# Altium project mementos.PrjPcb
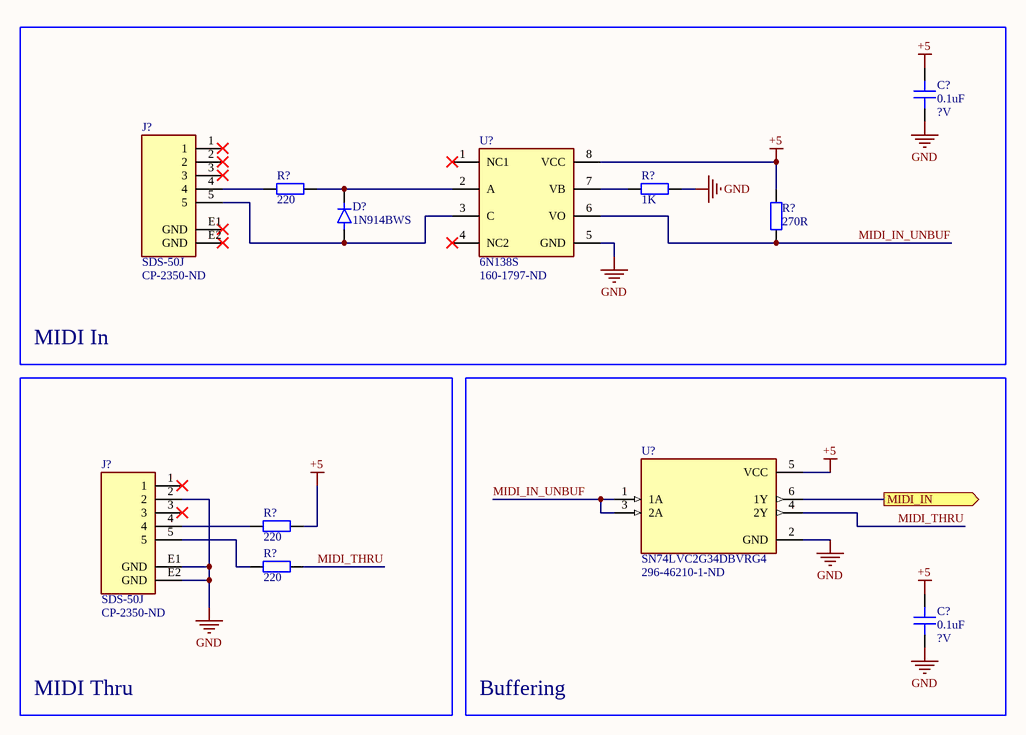
[diagram p0: MIDI.SchDoc]
4 sheets, 48 parts. Net scope: flat (ports and power ports of the same name join across sheets).
Sheets:
  Top.SchDoc
  MIDI.SchDoc
  Microphone.SchDoc
  Power.SchDoc

## Sheet Top.SchDoc
size A4; SheetNumber: 1; SheetTotal: 1

## Sheet MIDI.SchDoc
size A4; SheetNumber: 2; SheetTotal: 3

### Parts
(Parts that share a designator on the sheet are numbered #1, #2 ... from top to bottom, then left to right.)
C?#1  value 0.1uF  Voltage: ?V  [CAP 0402/1005]  (hidden comment: Capacitor_SMD)
C?#2  value 0.1uF  Voltage: ?V  [CAP 0402/1005]  (hidden comment: Capacitor_SMD)
D?  1N914BWS  [DIO_1N914BWS_RR]
J?#1  SDS-50J  Supplier Part Number 1: CP-2350-ND  [CUI_SDS-50J]
J?#2  SDS-50J  Supplier Part Number 1: CP-2350-ND  [CUI_SDS-50J]
R?#1  value 220  [RES 0805/2012]  (hidden comment: Resistor_SMD)
R?#2  value 1K  [RES 0805/2012]  (hidden comment: Resistor_SMD)
R?#3  value 270R  [RES 0805/2012]  (hidden comment: Resistor_SMD)
R?#4  value 220  [RES 0805/2012]  (hidden comment: Resistor_SMD)
R?#5  value 220  [RES 0805/2012]  (hidden comment: Resistor_SMD)
U?#1  6N138S  Supplier Part Number 1: 160-1797-ND  [SMDIP8]
U?#2  SN74LVC2G34DBVRG4  Supplier Part Number 1: 296-46210-1-ND  [SOT95P280X145-6N]

### Blocks framed on the sheet
MIDI In: C?#1 D? J?#1 R?#1-R?#3 U?#1
MIDI Thru: J?#2 R?#4 R?#5
Buffering: C?#2 U?#2

### Ports
MIDI_IN (out)

### Nets
+5: C?#1.1 C?#2.1 R?#3.1 R?#4.1 U?#1.8(VCC) U?#2.5(VCC)
GND: C?#1.2 C?#2.2 J?#2.2 J?#2.E1(GND) J?#2.E2(GND) R?#2.1 U?#1.5(GND) U?#2.2(GND)
MIDI_IN_UNBUF: R?#3.2 U?#1.6(VO) U?#2.1(1A) U?#2.3(2A)
MIDI_THRU: R?#5.1 U?#2.4(2Y)
NetD?_A: D?.A J?#1.5 U?#1.3(C)
NetD?_C: D?.C(K) R?#1.1 U?#1.2(A)
NetJ?#1_4: J?#1.4 R?#1.2
NetJ?#2_4: J?#2.4 R?#4.2
NetJ?#2_5: J?#2.5 R?#5.2
NetR?#2_2: R?#2.2 U?#1.7(VB)
NetU?#2_6: U?#2.6(1Y) ; port MIDI_IN

Not connected (* = marked no-connect by the designer): J?#1 1* 2* 3* E1(GND)* E2(GND)*; J?#2 1* 3*; U?#1 1(NC1)* 4(NC2)*

### Library data of the parts
C?#1 C?#2 = Capacitor_SMD: SMD Capacitor
D? = 1N914BWS: SOD-323F, 100V, 0.15A, Switching Diode & Array; MP: 1N914BWS RR; MF: Taiwan Semiconductor; Value: *; Check_prices: https://www.snapeda.com/parts/1N914BWS%20RR/Taiwan+Semiconductor/view-part/?ref=eda; Availability: In Stock; Price: None; Package: SOD-323F Taiwan Semiconductor; SnapEDA_Link: https://www.snapeda.com/parts/1N914BWS%20RR/Taiwan+Semiconductor/view-part/?ref=snap; Purchase-URL: https://pricing.snapeda.com/search/part/1N914BWS RR/?ref=eda
J?#1 J?#2 = SDS-50J: 5 Positions, Receptacle, Right Angle, Through Hole, Standard Circular DIN Connector; Value: *; MP: SDS-50J; Package: None; Availability: Unavailable; Price: None; Supplier 1: Digi-Key
R?#1-R?#5 = Resistor_SMD: SMD Resistor; Power: 100mW
U?#1 = 6N138S: Optoisolator Darlington with Base Output 5000Vrms 1 Channel 8-SMD; MF: ON Semiconductor; MP: 6N138S; SnapEDA_Link: https://www.snapeda.com/parts/6N138S/Onsemi/view-part/560668/?ref=snap; Check_prices: https://www.snapeda.com/parts/6N138S/Onsemi/view-part/560668/?ref=eda; Price: None; Availability: In Stock; Purchase-URL: https://pricing.snapeda.com/search/part/6N138S/?ref=eda; Package: SMD-8 ON Semiconductor; Value: *; Supplier 1: Digi-Key
U?#2 = SN74LVC2G34DBVRG4: Dual Buffer Gate 6-SOT-23 -40 to 125; MF: Texas Instruments; Value: *; Check_prices: https://www.snapeda.com/parts/SN74LVC2G34DBVRG4/Texas+Instruments/view-part/?ref=eda; Digi-Key_Part_Number: 296-46210-1-ND; Package: SOT-23-6 Texas Instruments; Purchase-URL: https://pricing.snapeda.com/search/part/SN74LVC2G34DBVRG4/?ref=eda; SnapEDA_Link: https://www.snapeda.com/parts/SN74LVC2G34DBVRG4/Texas+Instruments/view-part/?ref=snap; MP: SN74LVC2G34DBVRG4; Supplier 1: Digi-Key

## Sheet Microphone.SchDoc
size A4; SheetNumber: 3; SheetTotal: 3
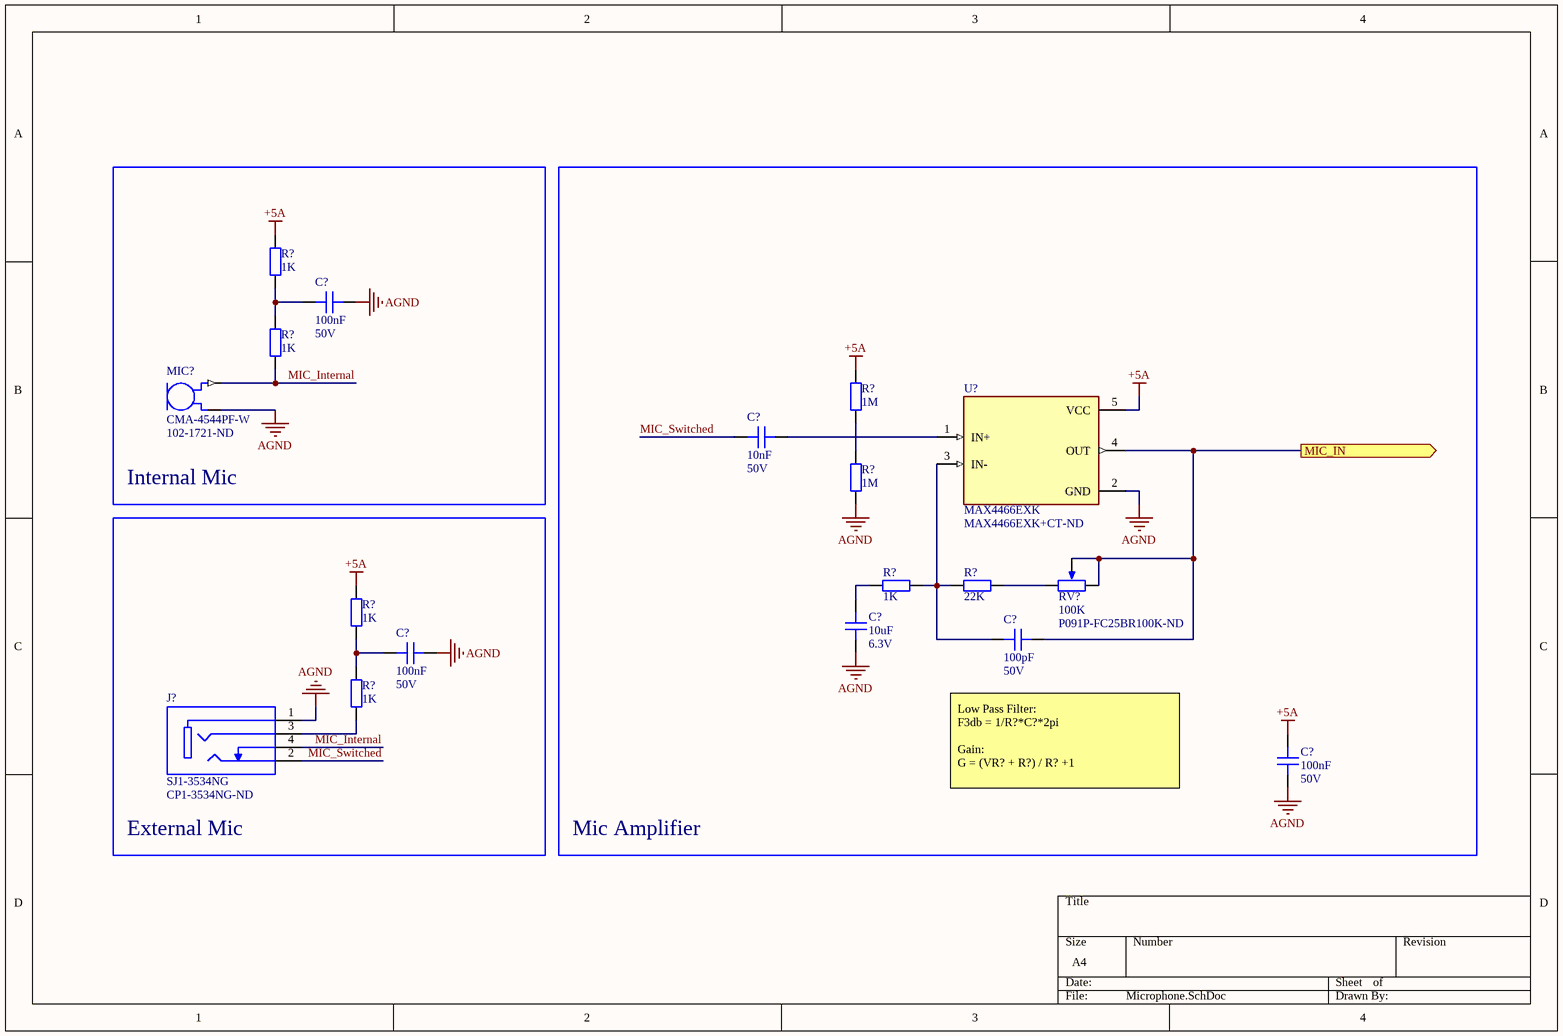
[diagram p1: Microphone.SchDoc]

### Parts
(Parts that share a designator on the sheet are numbered #1, #2 ... from top to bottom, then left to right.)
C?#3  value 100nF  Voltage: 50V  [CAP 0402/1005]  (hidden comment: Capacitor_SMD)
C?#4  value 10nF  Voltage: 50V  [CAP 0402/1005]  (hidden comment: Capacitor_SMD)
C?#5  value 10uF  Voltage: 6.3V  [CAP 0603/1608]  (hidden comment: Capacitor_SMD)
C?#6  value 100pF  Voltage: 50V  [CAP 0402/1005]  (hidden comment: Capacitor_SMD)
C?#7  value 100nF  Voltage: 50V  [CAP 0402/1005]  (hidden comment: Capacitor_SMD)
C?#8  value 100nF  Voltage: 50V  [CAP 0402/1005]  (hidden comment: Capacitor_SMD)
J?#3  SJ1-3534NG  Supplier Part Number 1: CP1-3534NG-ND  [CUI_SJ1-3534NG]
MIC?  CMA-4544PF-W  Supplier Part Number 1: 102-1721-ND  [MIC_CMA-4544PF-W]
R?#6  value 1K  [RES 0402/1005]  (hidden comment: Resistor_SMD)
R?#7  value 1K  [RES 0402/1005]  (hidden comment: Resistor_SMD)
R?#8  value 1M  [RES 0402/1005]  (hidden comment: Resistor_SMD)
R?#9  value 1M  [RES 0402/1005]  (hidden comment: Resistor_SMD)
R?#10  value 1K  [RES 0402/1005]  (hidden comment: Resistor_SMD)
R?#11  value 22K  [RES 0402/1005]  (hidden comment: Resistor_SMD)
R?#12  value 1K  [RES 0402/1005]  (hidden comment: Resistor_SMD)
R?#13  value 1K  [RES 0402/1005]  (hidden comment: Resistor_SMD)
RV?  value 100K  Supplier Part Number 1: P091P-FC25BR100K-ND  (hidden comment: P091P-FC25BR100K)
U?#3  MAX4466EXK  Supplier Part Number 1: MAX4466EXK+CT-ND  [SOT65P210X110-5N]

### Blocks framed on the sheet
Internal Mic: C?#3 MIC? R?#6 R?#7
Mic Amplifier: C?#4-C?#6 C?#8 R?#8-R?#11 RV? U?#3
External Mic: C?#7 J?#3 R?#12 R?#13

### Ports
MIC_IN (out)

### Nets
+5A: C?#8.2 R?#6.2 R?#8.2 R?#12.2 U?#3.5(VCC)
AGND: C?#3.2 C?#5.1 C?#7.2 C?#8.1 J?#3.1 MIC?.2(GND) R?#9.1 U?#3.2(GND)
MIC_Internal: J?#3.4 MIC?.1(OUT) R?#7.1
MIC_Switched: C?#4.1 J?#3.2
NetC?#3_1: C?#3.1 R?#6.1 R?#7.2
NetC?#4_2: C?#4.2 U?#3.1(IN+)
NetC?#5_2: C?#5.2 R?#10.2
NetC?#6_1: C?#6.1 RV?.2(TAP) RV?.3 U?#3.4(OUT) ; port MIC_IN
NetC?#6_2: C?#6.2 R?#10.1 R?#11.2 U?#3.3(IN-)
NetC?#7_1: C?#7.1 R?#12.1 R?#13.2
NetJ?#3_3: J?#3.3 R?#13.1
NetR?#8_1: R?#8.1 R?#9.2
NetR?#11_1: R?#11.1 RV?.1

### Notes on the sheet
- Low Pass Filter:
  F3db = 1/R?*C?*2pi
  Gain:
  G = (VR? + R?) / R? +1

### Library data of the parts
C?#3-C?#8 = Capacitor_SMD: SMD Capacitor
J?#3 = SJ1-3534NG: 3.5 mm, Stereo, Right Angle, Through Hole, Isolated Ground, Audio Jack Connector; MF: CUI Devices; SnapEDA_Link: https://www.snapeda.com/parts/SJ1-3534NG/CUI%20Devices/view-part/617954/?ref=snap; Price: None; MP: SJ1-3534NG; Package: None; Value: *; Availability: Unavailable; Supplier 1: Digi-Key
MIC? = CMA-4544PF-W: 9.7 mm, Omnidirectional, PCB Mount, 3.0 Vdc, Electret Condenser Microphone; MF: CUI Devices; CUI_purchase_URL: https://www.cuidevices.com/product/audio/microphones/electret-condenser-microphones/cma-4544pf-w?utm_source=snapeda.com&utm_medium=referral&utm_campaign=snapedaBOM; Price: None; SnapEDA_Link: https://www.snapeda.com/parts/CMA-4544PF-W/CUI%20Devices/view-part/215068/?ref=snap; Package: 6-DIP-6 CUI; Availability: Unavailable; Value: *; MP: CMA-4544PF-W; Supplier 1: Digi-Key
R?#6-R?#13 = Resistor_SMD: SMD Resistor; Power: 100mW
RV? = P091P-FC25BR100K: Potentiometer 9mm 100K ohm 20% Push Lock; Supplier 1: Digi-Key
U?#3 = MAX4466EXK: Amplifier IC 1-Channel _Mono_ Class AB SC-70-5; MF: Maxim Integrated; MP: MAX4466EXK+T; Price: None; Value: *; Package: SC-70-5 Maxim; SnapEDA_Link: https://www.snapeda.com/parts/MAX4466EXK%2BT/Maxim%20Integrated/view-part/548008/?ref=snap; Availability: Unavailable; Supplier 1: Digi-Key

## Sheet Power.SchDoc
size A4; SheetNumber: 4; SheetTotal: 4
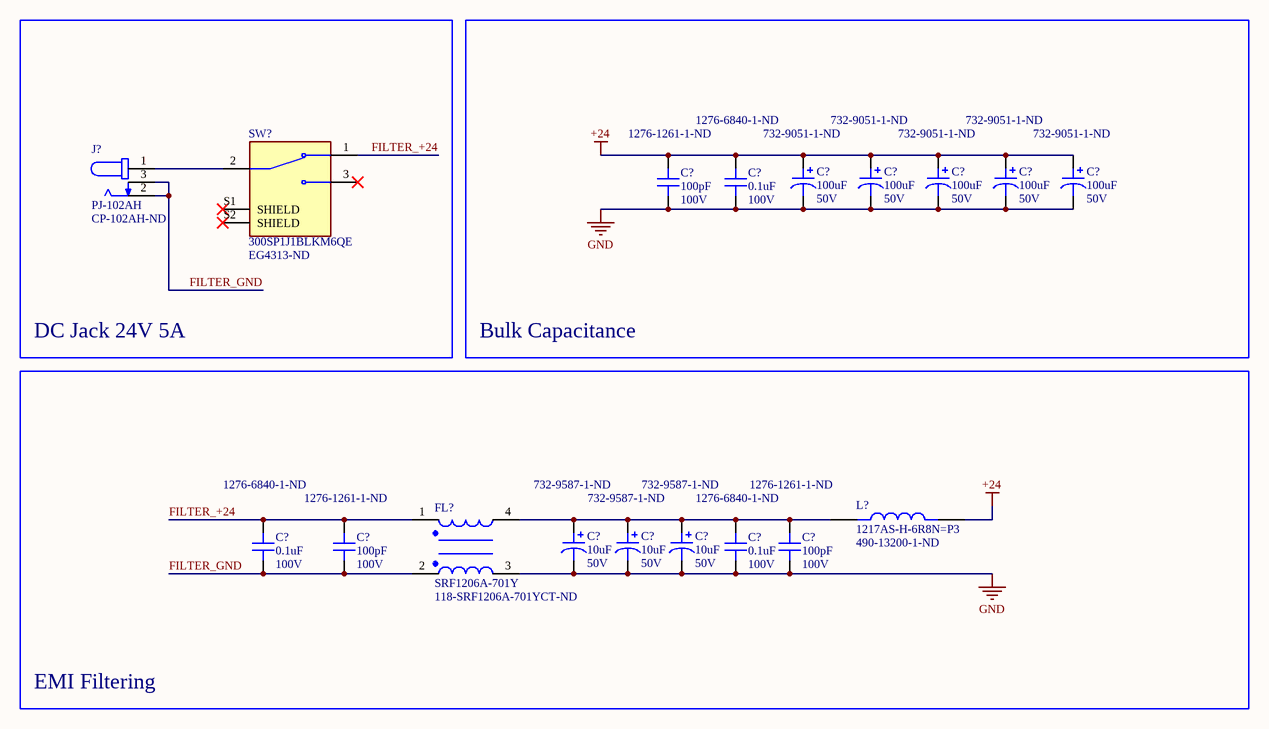
[diagram p2: Power.SchDoc]

### Parts
(Parts that share a designator on the sheet are numbered #1, #2 ... from top to bottom, then left to right.)
C?#9  value 100pF  Voltage: 100V  Supplier Part Number 1: 1276-1261-1-ND  [CAP 0402/1005]  (hidden comment: Capacitor_SMD)
C?#10  value 0.1uF  Voltage: 100V  Supplier Part Number 1: 1276-6840-1-ND  [CAP 0805/2012]  (hidden comment: Capacitor_SMD)
C?#11  value 100uF  Voltage: 50V  Supplier Part Number 1: 732-9051-1-ND  [CAP AL TH D8 L3.5 H21]  (hidden comment: Capacitor_Pol)
C?#12  value 100uF  Voltage: 50V  Supplier Part Number 1: 732-9051-1-ND  [CAP AL TH D8 L3.5 H21]  (hidden comment: Capacitor_Pol)
C?#13  value 100uF  Voltage: 50V  Supplier Part Number 1: 732-9051-1-ND  [CAP AL TH D8 L3.5 H21]  (hidden comment: Capacitor_Pol)
C?#14  value 100uF  Voltage: 50V  Supplier Part Number 1: 732-9051-1-ND  [CAP AL TH D8 L3.5 H21]  (hidden comment: Capacitor_Pol)
C?#15  value 100uF  Voltage: 50V  Supplier Part Number 1: 732-9051-1-ND  [CAP AL TH D8 L3.5 H21]  (hidden comment: Capacitor_Pol)
C?#16  value 0.1uF  Voltage: 100V  Supplier Part Number 1: 1276-6840-1-ND  [CAP 0805/2012]  (hidden comment: Capacitor_SMD)
C?#17  value 100pF  Voltage: 100V  Supplier Part Number 1: 1276-1261-1-ND  [CAP 0402/1005]  (hidden comment: Capacitor_SMD)
C?#18  value 10uF  Voltage: 50V  Supplier Part Number 1: 732-9587-1-ND  [CAP AL TH D5 L2 H12.5]  (hidden comment: Capacitor_Pol)
C?#19  value 10uF  Voltage: 50V  Supplier Part Number 1: 732-9587-1-ND  [CAP AL TH D5 L2 H12.5]  (hidden comment: Capacitor_Pol)
C?#20  value 10uF  Voltage: 50V  Supplier Part Number 1: 732-9587-1-ND  [CAP AL TH D5 L2 H12.5]  (hidden comment: Capacitor_Pol)
C?#21  value 0.1uF  Voltage: 100V  Supplier Part Number 1: 1276-6840-1-ND  [CAP 0805/2012]  (hidden comment: Capacitor_SMD)
C?#22  value 100pF  Voltage: 100V  Supplier Part Number 1: 1276-1261-1-ND  [CAP 0402/1005]  (hidden comment: Capacitor_SMD)
FL?  SRF1206A-701Y  Supplier Part Number 1: 118-SRF1206A-701YCT-ND
J?#4  PJ-102AH  Supplier Part Number 1: CP-102AH-ND  [CUI_PJ-102AH]
L?  1217AS-H-6R8N=P3  Supplier Part Number 1: 490-13200-1-ND  [IND_1217AS-H-6R8N=P3]
SW?  300SP1J1BLKM6QE  Supplier Part Number 1: EG4313-ND  [SW_300SP1J1BLKM6QE]

### Blocks framed on the sheet
DC Jack 24V 5A: J?#4 SW?
Bulk Capacitance: C?#9-C?#15
EMI Filtering: C?#16-C?#22 FL? L?

### Nets
+24: C?#9.1 C?#10.1 C?#11.1 C?#12.1 C?#13.1 C?#14.1 C?#15.1 L?.2
GND: C?#9.2 C?#10.2 C?#11.2 C?#12.2 C?#13.2 C?#14.2 C?#15.2 C?#18.2 C?#19.2 C?#20.2 C?#21.2 C?#22.2 FL?.3
FILTER_+24: C?#16.1 C?#17.1 FL?.1 SW?.1
FILTER_GND: C?#16.2 C?#17.2 FL?.2 J?#4.2 J?#4.3
NetC?#18_1: C?#18.1 C?#19.1 C?#20.1 C?#21.1 C?#22.1 FL?.4 L?.1
NetJ?#4_1: J?#4.1 SW?.2

Not connected (* = marked no-connect by the designer): SW? 3* S1(SHIELD)* S2(SHIELD)*

### Library data of the parts
C?#9 C?#10 C?#16 C?#17 C?#21 C?#22 = Capacitor_SMD: SMD Capacitor; Supplier 1: Digi-Key
C?#11-C?#15 C?#18-C?#20 = Capacitor_Pol: THT Polarised Capacitor; Supplier 1: Digi-Key
FL? = SRF1206A-701Y: Common Mode Choke 80VDC 8A; Value: 9uH; Supplier 1: Digi-Key
J?#4 = PJ-102AH: 2.0 x 6.5 mm, 5.0 A, Horizontal, Through Hole, Tapered Pins, Dc Power Jack Connector; MF: CUI Devices; Digi-Key_Part_Number: CP-102AH-ND; CUI_purchase_URL: https://www.cuidevices.com/product/interconnect/connectors/dc-power-connectors/jacks/pj-102ah?utm_source=snapeda.com&utm_medium=referral&utm_campaign=snapedaBOM; SnapEDA_Link: https://www.snapeda.com/parts/PJ-102AH/CUI%20Devices/view-part/228264/?ref=snap; Package: None; Value: *; Digi-Key_Purchase_URL: https://www.digikey.com/product-detail/en/cui-devices/PJ-102AH/CP-102AH-ND/408448?utm_source=snapeda&utm_medium=aggregator&utm_campaign=symbol; MP: PJ-102AH; Supplier 1: Digi-Key
L? = 1217AS-H-6R8N=P3: Inductor with Inductance: 6.8uH Tol. +/-30%, Package: 3131 (8080); MF: Murata; SnapEDA_Link: https://www.snapeda.com/parts/1217AS-H-6R8N=P3/Murata/view-part/?ref=snap; Digi-Key_Part_Number: 490-14059-2-ND; Purchase-URL: https://pricing.snapeda.com/search/part/1217AS-H-6R8N=P3/?ref=eda; Check_prices: https://www.snapeda.com/parts/1217AS-H-6R8N=P3/Murata/view-part/?ref=eda; Value: 6.8uH; Package: NONSTANDARD; MP: 1217AS-H-6R8N=P3; Supplier 1: Digi-Key
SW? = 300SP1J1BLKM6QE: Rocker Switch SPDT 5A (AC/DC) 120V Through Hole, Right Angle; MF: E-Switch; Value: *; Availability: Unavailable; Price: None; MP: 300SP1J1BLKM6QE; Package: None; SnapEDA_Link: https://www.snapeda.com/parts/300SP1J1BLKM6QE/E-Switch/view-part/585580/?ref=snap; Mouser-Purchase-URL: https://snapeda.com/shop?store=Mouser&id=585580; Supplier 1: Digi-Key

## Nets that join several sheets
GND: MIDI (8 pins), Power (13 pins)